# Altium schematic sheet LED.SchDoc
size A4
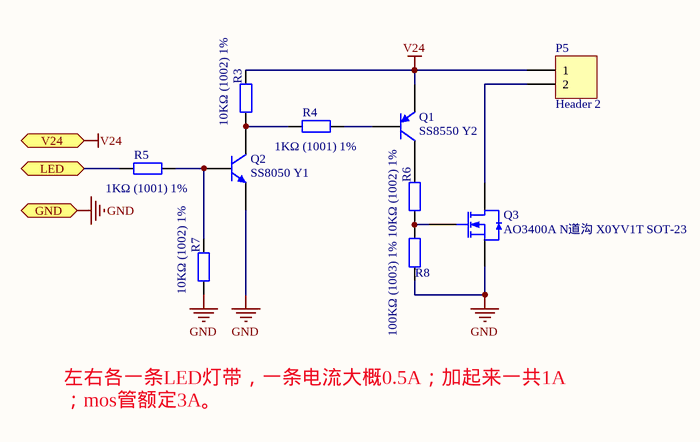
[diagram p0: LED.SchDoc]

## Parts
P5  Header 2  [2P_XH2.54]
Q1  SS8550 Y2  [SOT-23(SOT-23-3)]
Q2  SS8050 Y1  [SOT-23(SOT-23-3)]
Q3  AO3400A N道沟 X0YV1T SOT-23  [SOT-23-3L]
R3  10KΩ (1002) 1%  [0805_R]
R4  1KΩ (1001) 1%  [0805_R]
R5  1KΩ (1001) 1%  [0805_R]
R6  10KΩ (1002) 1%  [0805_R]
R7  10KΩ (1002) 1%  [0805_R]
R8  100KΩ (1003) 1%  [0805_R]

## Ports
GND, LED, V24

## Nets
GND: Q2.2(E) Q3.2(S) R7.1 R8.2 ; port GND
V24: P5.1 Q1.2(E) R3.2 ; port V24
LED: R5.2 ; port LED
NetP5_2: P5.2 Q3.3(D)
NetQ1_1: Q1.1(B) R4.1
NetQ1_3: Q1.3(C) R6.2
NetQ2_1: Q2.1(B) R5.1 R7.2
NetQ2_3: Q2.3(C) R3.1 R4.2
NetQ3_1: Q3.1(G) R6.1 R8.1

## Notes on the sheet
- 左右各一条LED灯带，一条电流大概0.5A；加起来一共1A；mos管额定3A。

## Library data of the parts
P5 = Header 2: Header, 2-Pin; LatestRevisionDate: 17-Jul-2002; LatestRevisionNote: Re-released for DXP Platform.; Publisher: Altium Limited
Q1 = SOT-23 SS8550 Y2: 三极管; ComponentLink1Description: 供应商链接; ComponentLink1URL: http://www.szlcsc.com/product/details_9037.html; Package: SOT-23; Supplier: LC; SuppliersPartNumber: C8542
Q2 = SOT-23 SS8050 Y1: 三极管; ComponentLink1Description: 供应商链接; ComponentLink1URL: http://www.szlcsc.com/product/details_2507.html; Package: SOT-23; Supplier: LC; SuppliersPartNumber: C2150
Q3 = AO3400A N道沟 X0YV1T SOT-23: MOS(场效应管); ComponentLink1Description: 供应商链接; ComponentLink1URL: http://www.szlcsc.com/product/details_21629.html; Package: SOT-23; Supplier: LC; SuppliersPartNumber: C20917
R3 R6 R7 = 0805 10KΩ (1002) 1%: 贴片电阻; ComponentLink1Description: 供应商链接; ComponentLink1URL: http://www.szlcsc.com/product/details_18102.html; Package: 0805; Supplier: LC; SuppliersPartNumber: C17414
R4 R5 = 0805 1KΩ (1001) 1%: 贴片电阻; ComponentLink1Description: 供应商链接; ComponentLink1URL: http://www.szlcsc.com/product/details_18201.html; Package: 0805; Supplier: LC; SuppliersPartNumber: C17513
R8 = 0805 100KΩ (1003) 1%: 贴片电阻; ComponentLink1Description: 供应商链接; ComponentLink1URL: http://www.szlcsc.com/product/details_18095.html; Package: 0805; Supplier: LC; SuppliersPartNumber: C17407